# Altium schematic sheet power-converter.SchDoc
size 297 x 209 mm
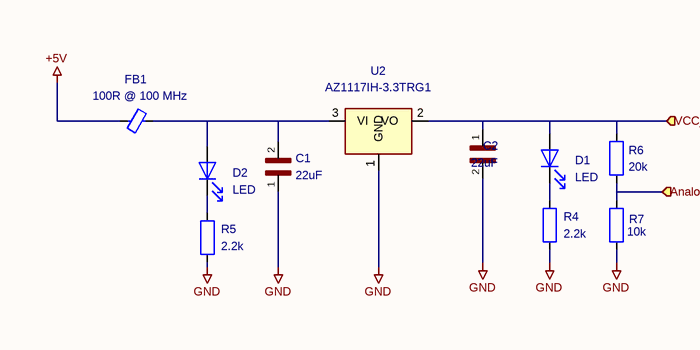
[diagram p0: power-converter.SchDoc]

## Parts
C1  22uF  [C_0603_1608Metric]
C2  22uF  [C_0603_1608Metric]
D1  LED  [LED_0603_1608Metric]
D2  LED  [LED_0603_1608Metric]
FB1  100R @ 100 MHz  [L_0603_1608Metric]
R4  2.2k  [R_0603_1608Metric]
R5  2.2k  [R_0603_1608Metric]
R6  20k  [R_0603_1608Metric]
R7  10k  [R_0603_1608Metric]
U2  AZ1117IH-3.3TRG1  [SOT-223-3_TabPin2]

## Ports
Analog Output Voltage (in), VCC_3V3 (in)

## Nets
+5V: FB1.2
GND: C1.1 C2.2 R4.2 R5.2 R7.2 U2.1(GND)
Analog Output Voltage: R6.2 R7.1 ; port Analog Output Voltage
VCC_3V3: C2.1 D1.2(A) R6.1 U2.2(VO) ; port VCC_3V3
NetC1_2: C1.2 D2.2(A) FB1.1 U2.3(VI)
NetD1_1: D1.1(K) R4.1
NetD2_1: D2.1(K) R5.1

## Notes on the sheet
- 1
- 2
- 3
- 4
- 5
- 6
- A
- B
- C
- D
- Title:
- File: power-converter.kicad_sch
- Sheet: /
- KiCad E.D.A.  kicad (5.1.4)-1
- Size: A4
- Date:
- Rev:
- Id: 1/1

## Library data of the parts
C1 C2 = CL10B104KB8NNNL: Value: 22uF; Footprint: Capacitor_SMD:C_0603_1608Metric
FB1 = FerriteBead_Small: Value: 100R @ 100 MHz; Footprint: Inductor_SMD:L_0603_1608Metric
R4-R7 = R: Footprint: Resistor_SMD:R_0603_1608Metric
  R4 R5: Value: 2.2k
  R6: Value: 20k
  R7: Value: 10k
U2 = AZ1117-3.3: Value: AZ1117IH-3.3TRG1; Footprint: Package_TO_SOT_SMD:SOT-223-3_TabPin2
D1 D2 = LED: Value: LED; Footprint: LED_SMD:LED_0603_1608Metric